# EAGLE design ESP_LoRa_Scale_V1.54 (EAGLE 9.6.0)
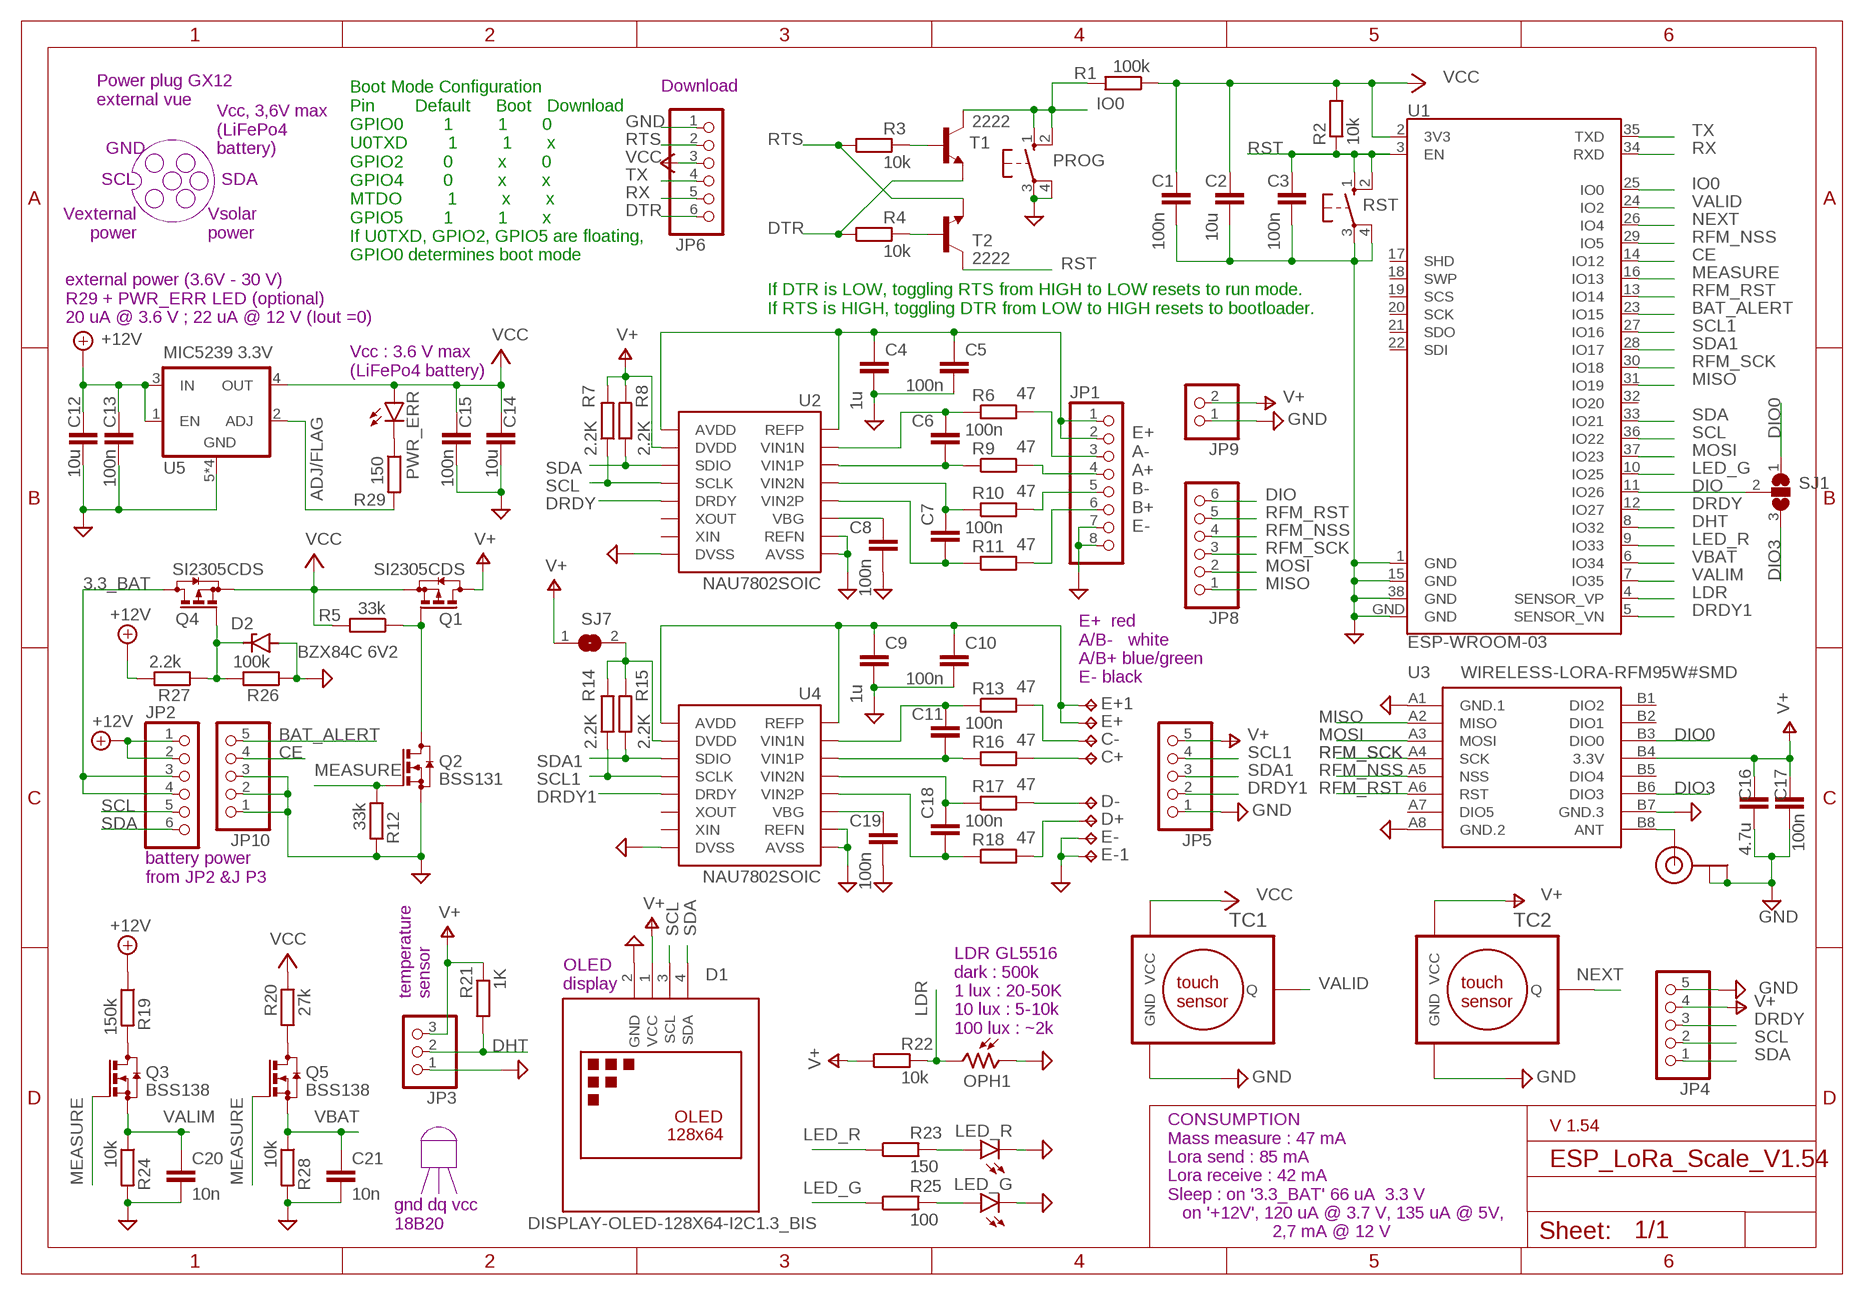
[diagram p0: schematic, sheet 1]

## Parts
C1  100n  CC1206  [C1206]
C2  10u  CC1210  [C1210]
C3  100n  CC1206  [C1206]
C4  1u  CC1210  [C1210]
C5  100n  CC1206  [C1206]
C6  100n  CC1206  [C1206]
C7  100n  CC1206  [C1206]
C8  100n  CC1206  [C1206]
C9  1u  CC1210  [C1210]
C10  100n  CC1206  [C1206]
C11  100n  CC1206  [C1206]
C12  10u  CC1210  [C1210]
C13  100n  CC1206  [C1206]
C14  10u  CC1210  [C1210]
C15  100n  CC1206  [C1206]
C16  4.7u  CC1210  [C1210]
C17  100n  CC1206  [C1206]
C18  100n  CC1206  [C1206]
C19  100n  CC1206  [C1206]
C20  10n  CC1206  [C1206]
C21  10n  CC1206  [C1206]
C+  TPTP17SQ  [TP17SQ]
C-  TPTP17SQ  [TP17SQ]
D1  DISPLAY-OLED-128X64-I2C1.3_BIS  [DISPLAY-OLED-128X64-1.3-I2C_BIS]
D2  BZX84C 6V2  BZX84CSMD  [TO236]
D+  TPTP17SQ  [TP17SQ]
D-  TPTP17SQ  [TP17SQ]
E+  TPTP17SQ  [TP17SQ]
E+1  TPTP17SQ  [TP17SQ]
E-  TPTP17SQ  [TP17SQ]
E-1  TPTP17SQ  [TP17SQ]
J1  U.FL  [U.FL]
JP1  PINHD-1X8  [1X08]
JP2  PINHD-1X6  [1X06]
JP3  PINHD-1X3  [1X03]
JP4  PINHD-1X5  [1X05]
JP5  PINHD-1X5  [1X05]
JP6  PINHD-1X6  [1X06]
JP8  PINHD-1X6  [1X06]
JP9  PINHD-1X2  [1X02]
JP10  PINHD-1X5  [1X05]
LED_G  LEDSMT1206  [1206]
LED_R  LEDSMT1206  [1206]
OPH1  VT93N2  [VT900]
PROG  10-XX  [B3F-10XX]
PWR_ERR  LEDSMT1206  [1206]
Q1  SI2305CDS  [SOT23]
Q2  BSS131  [SOT23]
Q3  BSS138  [SOT23]
Q4  SI2305CDS  [SOT23]
Q5  BSS138  [SOT23]
R1  100k  RR1206  [R1206]
R2  10k  RR1206  [R1206]
R3  10k  RR1206  [R1206]
R4  10k  RR1206  [R1206]
R5  33k  RR1206  [R1206]
R6  47  RR1206  [R1206]
R7  2.2K  RR1206  [R1206]
R8  2.2K  RR1206  [R1206]
R9  47  RR1206  [R1206]
R10  47  RR1206  [R1206]
R11  47  RR1206  [R1206]
R12  33k  RR1206  [R1206]
R13  47  RR1206  [R1206]
R14  2.2K  RR1206  [R1206]
R15  2.2K  RR1206  [R1206]
R16  47  RR1206  [R1206]
R17  47  RR1206  [R1206]
R18  47  RR1206  [R1206]
R19  150k  RR1206  [R1206]
R20  27k  RR1206  [R1206]
R21  1K  RR1206  [R1206]
R22  10k  RR1206  [R1206]
R23  150  RR1206  [R1206]
R24  10k  RR1206  [R1206]
R25  100  RR1206  [R1206]
R26  100k  RR1206  [R1206]
R27  2.2k  RR1206  [R1206]
R28  10k  RR1206  [R1206]
R29  150  RR1206  [R1206]
RST  10-XX  [B3F-10XX]
SJ1  SJ2W  [SJ_2]
SJ7  SJ  [SJ]
T1  2222  MMBT2222ALT1-NPN-SOT23-BEC  [SOT23-BEC]
T2  2222  MMBT2222ALT1-NPN-SOT23-BEC  [SOT23-BEC]
TC1  TTP223R_H  [TTP233RED_H]
TC2  TTP223R_H  [TTP233RED_H]
U1  ESP-WROOM-03  [ESP-WROOM-03]
U2  NAU7802SOIC  [SO16]
U3  WIRELESS-LORA-RFM95W#SMD  [WIRELESS-LORA-RFM95W#SMD]
U4  NAU7802SOIC  [SO16]
U5  MIC5239 3.3V  MIC5239-ADJMM  [MSOP08]

## Nets
3.3_BAT: JP2.3 JP2.4 Q4.3(D)
+12V: C12.1 C13.1 JP2.1 JP2.2 R19.1 R27.2 U5.1(EN) U5.3(IN)
A+: JP1.4 R9.2
A-: JP1.3 R6.2
ADJ/FLAG: R29.2 U5.2(ADJ)
ANT: J1.3(SIGNAL) U3.B8(ANT)
B+: JP1.6 R11.2
B-: JP1.5 R10.2
BAT_ALERT: JP10.5 U1.23(IO15)
CE: JP10.4 U1.14(IO12)
DHT: JP3.2 R21.1 U1.8(IO32)
DIO: JP8.6 SJ1.2 U1.11(IO26)
DIO0: SJ1.1 U3.B3(DIO0)
DIO3: SJ1.3 U3.B6(DIO3)
DRDY: JP4.3 U1.12(IO27) U2.12(DRDY)
DRDY1: JP5.2 U1.5(SENSOR_VN) U4.12(DRDY)
DTR: JP6.6 R4.1 T1.E
GND: C1.2 C2.2 C3.2 C4.2 C5.2 C8.2 C9.2 C10.2 C12.2 C13.2 C14.2 C15.2 C16.2 C17.2 C19.2 C20.2 C21.2 D1.2(GND) D2.A E-1.TP E-.TP J1.1(GND) J1.2(GND) JP1.7 JP1.8 JP3.1 JP4.5 JP5.1 JP6.1 JP9.1 JP10.1 JP10.2 JP10.3 LED_G.C LED_R.C OPH1.1 PROG.3(P) PROG.4(P1) Q2.2(S) R12.2 R24.2 R26.1 R28.2 RST.3(P) RST.4(P1) TC1.P$3(GND) TC2.P$3(GND) U1.1(GND) U1.15(GND) U1.38(GND) U1.GND U2.7(REFN) U2.8(AVSS) U2.9(DVSS) U3.A1(GND.1) U3.A8(GND.2) U3.B7(GND.3) U4.7(REFN) U4.8(AVSS) U4.9(DVSS) U5.5(GND) U5.6(GND) U5.7(GND) U5.8(GND)
IO0: PROG.1(S) PROG.2(S1) R1.2 T1.C U1.25(IO0)
LDR: OPH1.2 R22.2 U1.4(SENSOR_VP)
LED_G: R25.1 U1.10(IO25)
LED_R: R23.1 U1.9(IO33)
MEASURE: Q2.1(G) Q3.1(G) Q5.1(G) R12.1 U1.16(IO13)
MISO: JP8.1 U1.31(IO19) U3.A2(MISO)
MOSI: JP8.2 U1.37(IO23) U3.A3(MOSI)
N$1: Q1.1(G) Q2.3(D) R5.1
N$2: Q3.3(D) R19.2
N$4: R14.2 R15.2 SJ7.2 U4.15(DVDD)
N$5: Q5.3(D) R20.1
N$6: PWR_ERR.C R29.1
N$7: LED_R.A R23.2
N$8: LED_G.A R25.2
N$10: R3.2 T1.B
N$14: R4.2 T2.B
N$15: C8.1 U2.6(VBG)
N$16: C19.1 U4.6(VBG)
N$17: C11.2 R16.1 U4.3(VIN1P)
N$18: C11.1 R13.1 U4.2(VIN1N)
N$19: C6.2 R9.1 U2.3(VIN1P)
N$20: C6.1 R6.1 U2.2(VIN1N)
N$21: C7.1 R10.1 U2.4(VIN2N)
N$22: C7.2 R11.1 U2.5(VIN2P)
N$27: C18.1 R17.1 U4.4(VIN2N)
N$28: C18.2 R18.1 U4.5(VIN2P)
N$29: D+.TP R18.2
N$30: D-.TP R17.2
N$31: C9.1 C10.1 E+1.TP E+.TP U4.1(REFP) U4.16(AVDD)
N$32: C-.TP R13.2
N$33: C+.TP R16.2
N$34: C4.1 C5.1 JP1.1 JP1.2 U2.1(REFP) U2.16(AVDD)
N$35: D2.C Q4.1(G) R26.2 R27.1
NEXT: TC2.P$2(Q) U1.26(IO4)
RFM_NSS: JP8.4 U1.29(IO5) U3.A5(NSS)
RFM_RST: JP8.5 U1.13(IO14) U3.A6(RST)
RFM_SCK: JP8.3 U1.30(IO18) U3.A4(SCK)
RST: C3.1 R2.1 RST.1(S) RST.2(S1) T2.C U1.3(EN)
RTS: JP6.2 R3.1 T2.E
RX: JP6.5 U1.34(RXD)
SCL: D1.3(SCL) JP2.5 JP4.2 R7.1 U1.36(IO22) U2.13(SCLK)
SCL1: JP5.4 R14.1 U1.27(IO16) U4.13(SCLK)
SDA: D1.4(SDA) JP2.6 JP4.1 R8.1 U1.33(IO21) U2.14(SDIO)
SDA1: JP5.3 R15.1 U1.28(IO17) U4.14(SDIO)
TX: JP6.4 U1.35(TXD)
V+: C16.1 C17.1 D1.1(VCC) JP3.3 JP4.4 JP5.5 JP9.2 Q1.3(D) R7.2 R8.2 R21.2 R22.1 SJ7.1 TC2.P$1(VCC) U2.15(DVDD) U3.B4(3.3V)
VALID: TC1.P$2(Q) U1.24(IO2)
VALIM: C20.1 Q3.2(S) R24.1 U1.7(IO35)
VBAT: C21.1 Q5.2(S) R28.1 U1.6(IO34)
VCC: C1.1 C2.1 C14.1 C15.1 JP6.3 PWR_ERR.A Q1.2(S) Q4.2(S) R1.1 R2.2 R5.2 R20.2 TC1.P$1(VCC) U1.2(3V3) U5.4(OUT)
Unconnected: U1.17(SHD) U1.18(SWP) U1.19(SCS) U1.20(SCK) U1.21(SDO) U1.22(SDI) U1.32(IO20) U2.10(XIN) U2.11(XOUT) U3.A7(DIO5) U3.B1(DIO2) U3.B2(DIO1) U3.B5(DIO4) U4.10(XIN) U4.11(XOUT)

## Notes on the sheet
- Download
- Power plug GX12
  external vue
- GND
- Vcc, 3,6V max
  (LiFePo4
  battery)
- SCL | SDA
- Vexternal
  power
- Vsolar 
  power
- Boot Mode Configuration
  Pin        Default     Boot   Download
  GPIO0        1         1       0
  U0TXD        1         1       x
  GPIO2        0         x       0
  GPIO4        0         x       x
  MTDO         1         x       x
  GPIO5        1         1       x
  If U0TXD, GPIO2, GPIO5 are floating, 
  GPIO0 determines boot mode
- If DTR is LOW, toggling RTS from HIGH to LOW resets to run mode.
  If RTS is HIGH, toggling DTR from LOW to HIGH resets to bootloader.
- external power (3.6V - 30 V)
  R29 + PWR_ERR LED (optional)
  20 uA @ 3.6 V ; 22 uA @ 12 V (Iout =0)
- Vcc : 3.6 V max 
  (LiFePo4 battery)
- E+
  A-
  A+
  B-
  B+
  E-
- E+  red
  A/B-   white
  A/B+ blue/green
  E- black
- battery power
  from JP2 &J P3
- OLED 
  display
- temperature
  sensor
- LDR GL5516
  dark : 500k
  1 lux : 20-50K
  10 lux : 5-10k
  100 lux : ~2k
- V 1.54
- gnd dq vcc
  18B20
- CONSUMPTION
  Mass measure : 47 mA
  Lora send : 85 mA
  Lora receive : 42 mA
  Sleep : on '3.3_BAT' 66 uA  3.3 V
     on '+12V', 120 uA @ 3.7 V, 135 uA @ 5V,
                       2,7 mA @ 12 V

## Library data of the parts
C1-C21 = eagle-ltspice:C: CAPACITOR, European symbol; SPICEMODEL: NONE; SPICEPREFIX: C
C+ C- D+ D- E+ E+1 E- E-1 = testpad:TP: Test pad
D1 = diy-modules1.8-perso:DISPLAY-OLED-128X64-I2C: 128x64 Dot Matrix OLED Module based on SSD1306 chip Variant with I2C interface More details available here: http://www.instructables.com/id/Monochrome-096-i2c-OLED-display-with-arduino-SSD13/ SSD1306 datasheet: https://cdn-shop.adafruit.com/datasheets/SSD1306.pdf Click here to find device on ebay.com <http://www.ebay.com/sch/oled+display+128x64+iic> Note: There are two variants: I2C and SPI. Search for the proper version.
D2 = diode:BZX84CSMD: Z DIODE
J1 = microbuilder:U.FL: U.FL Antenna Connector
JP1 = pinhead:PINHD-1X8: PIN HEADER
JP2 JP6 JP8 = pinhead:PINHD-1X6: PIN HEADER
JP3 = pinhead:PINHD-1X3: PIN HEADER
JP4 JP5 JP10 = pinhead:PINHD-1X5: PIN HEADER
JP9 = pinhead:PINHD-1X2: PIN HEADER
LED_G LED_R PWR_ERR = led:LED: LED OSRAM: - CHIPLED LG R971, LG N971, LY N971, LG Q971, LY Q971, LO R971, LY R971 LH N974, LH R974 LS Q976, LO Q976, LY Q976 LO Q996 - Hyper CHIPLED LW Q18S LB Q993, LB Q99A, LB R99A - SideLED LS A670, LO A670, LY A670, LG A670, LP A670 LB A673, LV A673, LT A673, LW A673 LH A674 LY A675 LS A676, LA A676, LO A676, LY A676, LW A676 LS A679, LY A679, LG A679 - Hyper Micro SIDELED® LS Y876, LA Y876, LO Y876, LY Y876 LT Y87S - SmartLED LW L88C, LW L88S LB L89C, LB L89S, LG L890 LS L89K, LO L89K, LY L89K LS L896, LA L896, LO L896, LY L896 - TOPLED LS T670, LO T670, LY T670, LG T670, LP T670 LSG T670, LSP T670, LSY T670, LOP T670, LYG T670 LG T671, LOG T671, LSG T671 LB T673, LV T673, LT T673, LW T673 LH T674 LS T676, LA T676, LO T676, LY T676, LB T676, LH T676, LSB T676, LW T676 LB T67C, LV T67C, LT T67C, LS T67K, LO T67K, LY T67K, LW E67C LS E67B, LA E67B, LO E67B, LY E67B, LB E67C, LV E67C, LT E67C LW T67C LS T679, LY T679, LG T679 LS T770, LO T770, LY T770, LG T770, LP T770 LB T773, LV T773, LT T773, LW T773 LH T774 LS E675, LA E675, LY E675, LS T675 LS T776, LA T776, LO T776, LY T776, LB T776 LHGB T686 LT T68C, LB T68C - Hyper Mini TOPLED® LB M676 - Mini TOPLED Santana® LG M470 LS M47K, LO M47K, LY M47K Source: http://www.osram.convergy.de LUXEON: - LUMILED® LXK2-PW12-R00, LXK2-PW12-S00, LXK2-PW14-U00, LXK2-PW14-V00 LXK2-PM12-R00, LXK2-PM12-S00, LXK2-PM14-U00 LXK2-PE12-Q00, LXK2-PE12-R00, LXK2-PE12-S00, LXK2-PE14-T00, LXK2-PE14-U00 LXK2-PB12-K00, LXK2-PB12-L00, LXK2-PB12-M00, LXK2-PB14-N00, LXK2-PB14-P00, LXK2-PB14-Q00 LXK2-PR12-L00, LXK2-PR12-M00, LXK2-PR14-Q00, LXK2-PR14-R00 LXK2-PD12-Q00, LXK2-PD12-R00, LXK2-PD12-S00 LXK2-PH12-R00, LXK2-PH12-S00 LXK2-PL12-P00, LXK2-PL12-Q00, LXK2-PL12-R00 Source: www.luxeon.com KINGBRIGHT: KA-3528ASYC Source: www.kingbright.com
OPH1 = photo-elements:VT9: Photoconductive Cell VT900 Series Source: http://optoelectronics.perkinelmer.com/content/Datasheets/DTS_vt900seriesdatasheet.pdf
PROG RST = switch-omron:10-XX: OMRON SWITCH; MPN: B3F-1000; OC_FARNELL: 176432; OC_NEWARK: 36M3542
Q1 Q4 = transistor-small-signal-perso:SI2305CDS: P-CHANNEL MOS FET
Q2 = transistor-small-signal-perso:BSS131: N-CHANNEL MOS FET
Q3 Q5 = detect:BSS138: N-CHANNEL MOS FET
R1-R29 = eagle-ltspice:R: RESISTOR, European symbol; SPICEMODEL: NONE; SPICEPREFIX: R
SJ1 = jumper:SJ2W: SMD solder JUMPER
SJ7 = jumper:SJ: SMD solder JUMPER
T1 T2 = transistor:*-NPN-: NPN Transistror BF959 corrected 2008.03.06
TC1 TC2 = esp32-lora:TTP223: Touch Key Switch
U1 = esp32-sparkfun (1):ESP-WROOM-03; OC_FARNELL: unknown
U2 U4 = SparkFun-IC-Conversion:NAU7802: 24-bit load cell conversion IC with I2C interface in SOIC-16 package. Similar to HX711 but with true I2C interface.; PROD_ID: IC-14299
U3 = diy-modules:WIRELESS-LORA-RFM95W: 868/915 MHz LoRa Radio Transceiver Module based on SX1276 chip Click here to find device on ebay.com <http://www.ebay.com/sch/RFM95W+transceiver>
U5 = micrel:MIC5239-ADJ: LDO REGULATOR

## Board
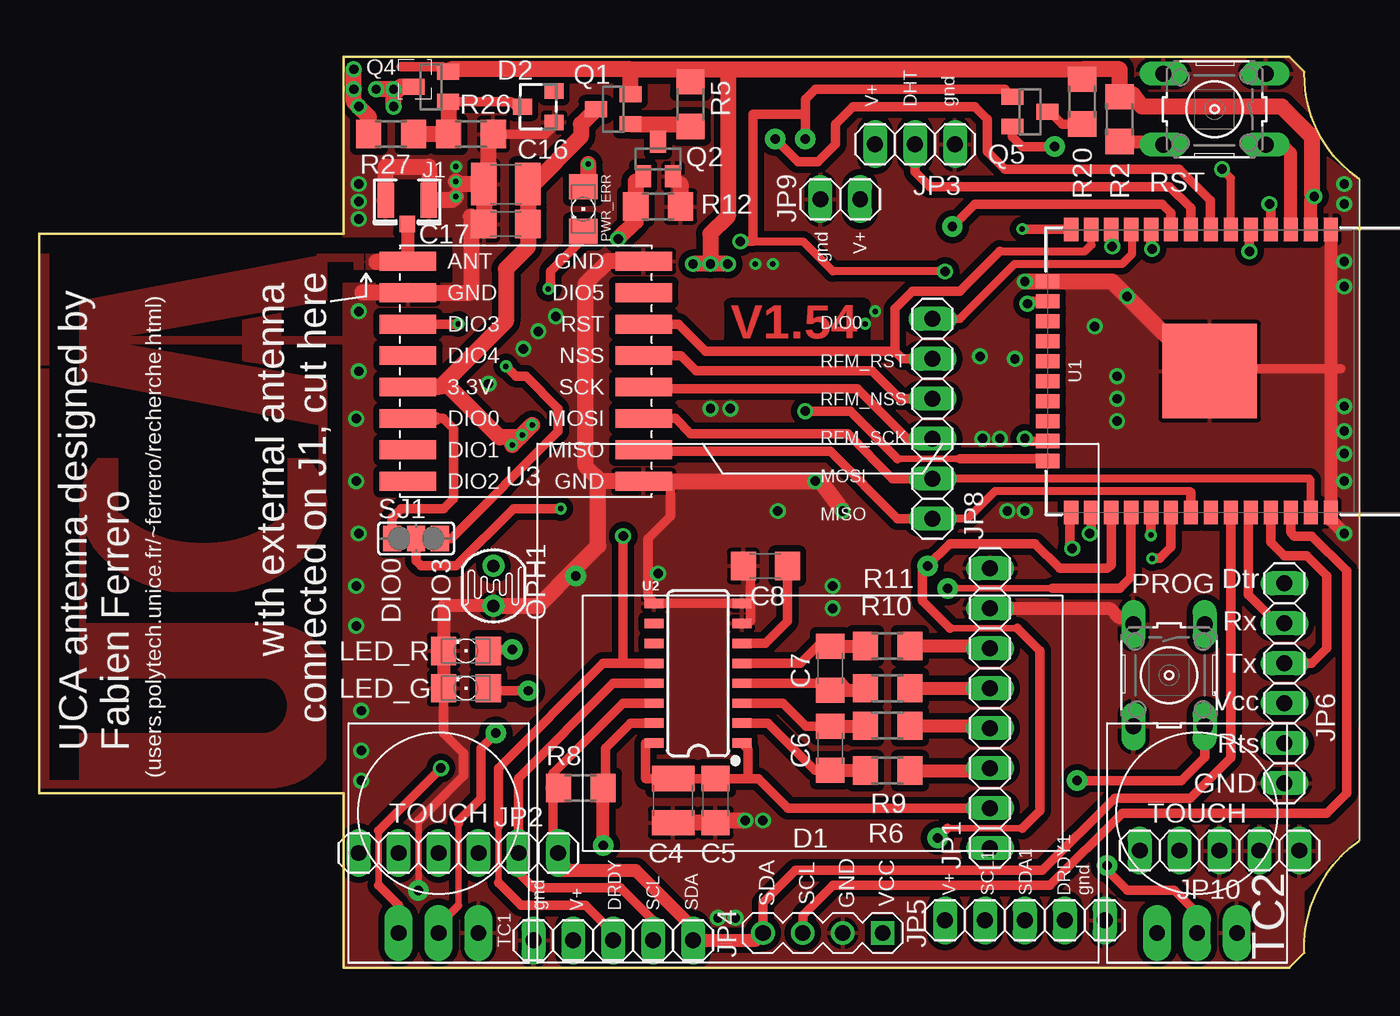
[diagram p1: board, top side]
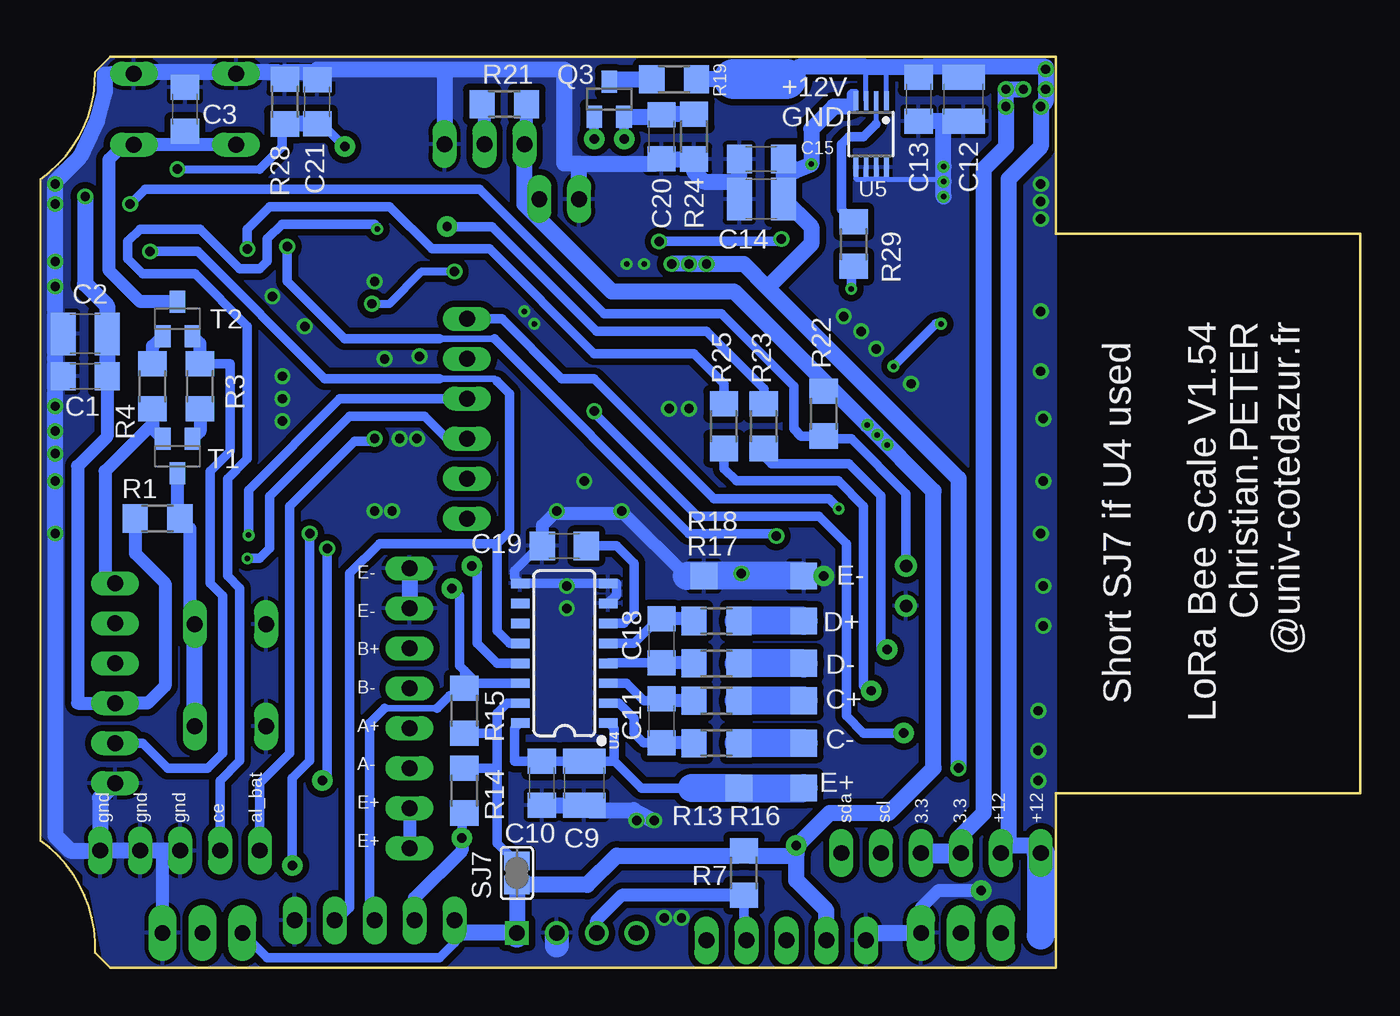
[diagram p2: board, bottom side, seen from below]

Size 83.98 x 57.94 mm. Coordinates in mm from the lower left corner, seen from the top.
Outline: 19.37,0 19.37,11.11 0,11.11 0,46.67 19.37,46.67 19.37,57.94 79.53,57.94 80.49,56.99 arc56 83.98,50.16 83.98,8.1 arc56 80.49,0.95 79.53,0 19.37,0
Copper layers (1*16): Top 0.035mm / dielectric 1.5mm / Bottom 0.035mm
Design rules "default *": minimum track width 6mil, minimum drill 0.35mm, track to track 6mil, track to pad 6mil, pad to pad 6mil, via to via 6mil, smd to smd 6mil, copper to edge 0mil, drill to drill 6mil, minimum pad ring 10mil, minimum via ring 8mil, stop-mask expansion 4mil, vias tented up to drill 0mil, thermal gap 10mil

### Footprints (pad centres in the part's own frame; a part is rotated, then mirrored left to right if it is on the bottom)
C1206 = smd 1.6 x 1.8: 1 -1.4,0; 2 1.4,0
C1210 = smd 1.6 x 2.7: 1 -1.4,0; 2 1.4,0
TP17SQ = smd 1.7 x 1.7: TP 0,0
DISPLAY-OLED-128X64-1.3-I2C_BIS = drill 1 square: 1 -3.81,14.605 | drill 1: 2 -1.27,14.605; 3 1.27,14.605; 4 3.81,14.605
TO236 = smd 1 x 1.2: A -1,-1; C 0,1; NC 1,-1
U.FL = smd 2.2 x 1.05: 1 0,1.375; 2 0,-1.375 | smd 1.05 x 1: 3 1.525,0
1X08 = drill 1.016 long: 1 -8.89,0; 2 -6.35,0; 3 -3.81,0; 4 -1.27,0; 5 1.27,0; 6 3.81,0; 7 6.35,0; 8 8.89,0
1X06 = drill 1.016 long: 1 -6.35,0; 2 -3.81,0; 3 -1.27,0; 4 1.27,0; 5 3.81,0; 6 6.35,0
1X03 = drill 1.016 long: 1 -2.54,0; 2 0,0; 3 2.54,0
1X05 = drill 1.016 long: 1 -5.08,0; 2 -2.54,0; 3 0,0; 4 2.54,0; 5 5.08,0
1X02 = drill 1.016 long: 1 -1.27,0; 2 1.27,0
1206 = smd 1.6 x 1.803: A -1.422,0; C 1.422,0
VT900 = drill 0.8 pad 1.4: 1 -1.27,0; 2 1.27,0
B3F-10XX = drill 1.016 long: 1 -3.251,2.261; 2 3.251,2.261; 3 -3.251,-2.261; 4 3.251,-2.261
SOT23 = smd 1 x 1.4: 1 -0.95,-1.1; 2 0.95,-1.1; 3 0,1.1
R1206 = smd 1.6 x 1.803: 1 -1.422,0; 2 1.422,0
SJ_2 = smd 1.168 x 1.6: 1 -1.524,0; 2 0,0; 3 1.524,0
SJ = smd 1.168 x 1.6: 1 -0.762,0; 2 0.762,0
SOT23-BEC = smd 1 x 1.4: B -0.95,-1.1; C 0,1.1; E 0.95,-1.1
TTP233RED_H = drill 1 pad 1.778 long: P$1 1.905,2.54; P$2 1.905,0; P$3 1.905,-2.54
ESP-WROOM-03 = smd 0.9 x 1.5: 1 7.7,9; 2 6.43,9; 3 5.16,9; 4 3.89,9; 5 2.62,9; 6 1.35,9; 7 0.08,9; 8 -1.19,9; 9 -2.46,9; 10 -3.73,9; 11 -5,9; 12 -6.27,9; 13 -7.54,9; 14 -8.81,9; 25 -8.81,-9; 26 -7.54,-9; 27 -6.27,-9; 28 -5,-9; 29 -3.73,-9; 30 -2.46,-9; 31 -1.19,-9; 32 0.08,-9; 33 1.35,-9; 34 2.62,-9; 35 3.89,-9; 36 5.16,-9; 37 6.43,-9; 38 7.7,-9 | smd 1.5 x 0.9: 15 -10.3,5.715; 16 -10.3,4.445; 17 -10.3,3.175; 18 -10.3,1.905; 19 -10.3,0.635; 20 -10.3,-0.635; 21 -10.3,-1.905; 22 -10.3,-3.175; 23 -10.3,-4.445; 24 -10.3,-5.715 | smd 6 x 6: GND 0,0
SO16 = smd 0.6 x 1.2: 1 -4.445,-2.8; 2 -3.175,-2.8; 3 -1.905,-2.8; 4 -0.635,-2.8; 5 0.635,-2.8; 6 1.905,-2.8; 7 3.175,-2.8; 8 4.445,-2.8; 9 4.445,2.8; 10 3.175,2.8; 11 1.905,2.8; 12 0.635,2.8; 13 -0.635,2.8; 14 -1.905,2.8; 15 -3.175,2.8; 16 -4.445,2.8
WIRELESS-LORA-RFM95W#SMD = smd 3.6 x 1.2: A1 -7.5,7; A2 -7.5,5; A3 -7.5,3; A4 -7.5,1; A5 -7.5,-1; A6 -7.5,-3; A7 -7.5,-5; A8 -7.5,-7; B1 7.5,7; B2 7.5,5; B3 7.5,3; B4 7.5,1; B5 7.5,-1; B6 7.5,-3; B7 7.5,-5; B8 7.5,-7
MSOP08 = smd 0.3 x 1.2: 1 -0.976,-2.113; 2 -0.326,-2.113; 3 0.324,-2.113; 4 0.974,-2.113; 5 0.974,2.112; 6 0.324,2.112; 7 -0.326,2.112; 8 -0.976,2.112

### Placement (x,y rotation side)
C1  81.12,37.62 180 bottom
C2  81.12,40.32 180 bottom
C3  74.77,54.61 90 bottom
C4  40.32,10.64 270 top
C5  43.02,10.64 270 top
C6  50.32,13.97 90 top
C7  50.32,19.05 90 top
C8  46.2,25.56 180 top
C9  49.37,11.75 270 bottom
C10  52.07,11.75 270 bottom
C11  44.45,15.72 90 bottom
C12  25.24,55.25 270 bottom
C13  28.1,55.25 270 bottom
C14  38.1,48.9 180 bottom
C15  38.1,51.44 180 bottom
C16  29.69,49.85 180 top
C17  29.69,47.31 180 top
C18  44.45,20.8 90 bottom
C19  50.64,26.83 180 bottom
C20  44.45,52.86 270 bottom
C21  66.36,55.09 90 bottom
C+  35.4,16.99 180 bottom
C-  35.4,14.29 180 bottom
D1  49.85,16.83 180 top
D2  31.75,54.77 90 top
D+  35.4,22.07 180 bottom
D-  35.4,19.37 180 bottom
E+  39.53,11.43 180 bottom
E+1  35.4,11.43 0 bottom
E-  35.4,24.92 180 bottom
E-1  41.75,24.92 0 bottom
J1  23.42,48.82 270 top
JP1  60.48,16.51 90 top
JP2  26.67,7.3 0 top
JP3  55.72,52.39 180 top
JP4  36.51,1.75 180 top
JP5  62.71,3.02 180 top
JP6  79.22,18.1 90 top
JP8  56.83,34.93 90 top
JP9  50.96,48.9 0 top
JP10  75.09,7.46 180 top
LED_G  27.15,17.78 180 top
LED_R  27.15,20.16 180 top
OPH1  28.89,24.29 90 top
PROG  71.88,18.61 270 top
PWR_ERR  34.61,48.26 270 top
Q1  36.51,54.61 90 top
Q2  39.37,51.44 0 top
Q3  47.78,55.25 0 bottom
Q4  24.92,56.04 90 top
Q5  63.02,54.45 270 top
R1  76.52,28.58 0 bottom
R2  68.74,53.98 90 top
R3  73.82,36.99 270 bottom
R4  76.84,36.99 90 bottom
R5  41.43,54.93 90 top
R6  53.98,12.54 0 top
R7  39.21,6.03 90 bottom
R8  34.45,11.43 0 top
R9  53.98,15.4 0 top
R10  53.98,17.78 0 top
R11  53.98,20.48 0 top
R12  39.37,48.42 0 top
R13  40.96,14.29 0 bottom
R14  56.99,11.27 90 bottom
R15  56.99,16.35 270 bottom
R16  40.96,16.99 0 bottom
R17  40.96,19.37 0 bottom
R18  40.96,22.07 0 bottom
R19  43.66,56.52 180 bottom
R20  66.36,55.09 90 top
R21  54.45,54.93 0 bottom
R22  34.13,35.24 270 bottom
R23  37.94,34.45 270 bottom
R24  42.39,52.86 270 bottom
R25  40.48,34.45 270 bottom
R26  27.46,53.02 180 top
R27  22.38,53.02 180 top
R28  68.42,55.09 90 bottom
R29  32.23,46.04 90 bottom
RST  74.77,54.61 180 top
SJ1  23.97,27.3 0 top
SJ7  53.66,6.03 90 bottom
T1  75.25,32.54 180 bottom
T2  75.25,41.27 0 bottom
TC1  25.4,0.32 90 top
TC2  73.66,0.32 90 top
U1  74.46,37.95 0 top
U2  41.91,18.73 90 top
U3  30.96,37.94 180 top
U4  50.64,20 90 bottom
U5  31.12,53.02 180 bottom

### Tracks (layer width: path | path; a pad name or v marks a point on that pad's centre or on a via)
3.3_BAT  (via drill 0.6)
  Top 1.016: 22.86,55.88 v21.43,55.88 | Q4.3 23.02,56.04 22.86,55.88 | v22.54,54.77 22.54,55.56 22.86,55.88
  Bottom 1.016: v21.43,55.88 v22.54,55.88 v22.54,54.77 22.54,52.23 23.97,50.8 23.97,9.84 25.4,8.41 JP2.3
  Bottom 1.27: JP2.4 JP2.3
+12V  (via drill 0.6)
  Top 1.016: R27.2 20.96,54.13 v20.32,54.77 20,55.09 v20,55.88 v20,57.15
  Bottom 0.305: 27.79,57.3 27.78,57.31 | U5.3 31.44,57.3 31.43,57.31 | U5.1 30.14,57.29 30.16,57.31
  Bottom 1.016: 25.24,57.31 20,57.31 20,55.09 v20.32,54.77 20.32,52.23 22.38,50.16 22.38,7.78 | 25.24,57.31 27.78,57.31 30.16,57.31 31.43,57.31 | C12.1 25.24,57.31 | C13.1 28.1,56.99 27.79,57.3 | 39.85,56.51 R19.1 | 31.44,57.3 35.73,57.3 36.51,56.51 | 22.38,7.78 JP2.2 | JP2.1 20.8,7.78 22.38,7.78
  Bottom 1.778: JP2.1 20.32,2.06
  Bottom 2.54: 36.51,56.51 39.85,56.51
A+
  Top 0.813: R9.2 60.33,15.4 JP1.4
A-
  Top 0.813: R6.2 60.33,12.54 JP1.3
ADJ/FLAG
  Bottom 0.305: U5.2 30.8,53.66
  Bottom 0.61: 30.8,53.66 31.59,52.86 32.54,52.86 33.02,52.39 33.02,48.25 R29.2
ANT
  Top 0.813: U3.B8 23.46,47.25 J1.3
  Top 1.016: U3.B8 23.42,44.9 21.45,44.9
  pour Top: 14.99,11.42 0.14,11.42 0.14,38.12 0.64,38.12 0.64,11.92 2.54,11.92 2.54,14.92 14.19,14.92 14.32,14.92 14.46,14.94 14.59,14.97 14.73,15.02 14.85,15.08 14.97,15.15 15.09,15.23 15.2,15.33 15.3,15.43 15.39,15.54 15.48,15.66 15.55,15.79 15.61,15.93 15.67,16.07 15.71,16.21 15.74,16.36 15.76,16.51 15.76,16.67 15.76,16.82 15.74,16.97 15.71,17.12 15.67,17.26 15.61,17.41 15.55,17.54 15.48,17.67 15.39,17.79 15.3,17.9 15.2,18 15.09,18.1 14.97,18.18 14.85,18.25 14.73,18.31 14.59,18.36 14.46,18.39 14.32,18.41 14.19,18.42 2.54,18.42 2.54,28.92 2.57,28.92 2.55,29.53 2.61,30.14 2.75,30.73 2.99,31.34 3.31,31.9 3.72,32.41 5.03,32.41 5.03,28.92 5.17,28.92 5.5,28.62 5.85,28.36 6.22,28.12 6.63,27.89 7.06,27.69 7.5,27.51 7.96,27.36 8.44,27.24 8.92,27.14 9.42,27.07 9.92,27.02 10.42,27.01 10.92,27.02 11.42,27.07 11.92,27.14 12.41,27.24 12.88,27.36 13.35,27.51 13.78,27.69 14.21,27.89 14.62,28.12 14.99,28.36 15.34,28.62 15.67,28.92 15.82,28.92 15.82,32.41 17.13,32.41 17.25,32.26 17.37,32.11 17.49,31.94 17.59,31.78 17.69,31.62 17.79,31.45 17.79,34.51 2.54,37.42 2.54,42.41 17.64,45.29 17.64,45.42 20.14,45.42 20.14,45.41 20.64,45.41 20.64,44.93 20.76,44.93 20.76,45.41 22.54,45.41 22.54,44.39 20.77,44.39 20.77,44.87 20.64,44.87 20.64,44.4 19.99,44.4 19.99,44.92 18.31,44.92 18.31,42.41 5.61,40.17 12.91,40.17 12.91,41.22 15.4,41.66 15.4,40.17 19.99,40.17 19.99,40.42 20.39,40.42 20.39,39.41 19.99,39.41 19.99,39.67 15.4,39.67 15.4,38.16 14.21,38.38 13.08,38.55 13.08,38.59 12.91,38.61 12.91,39.67 5.61,39.67 18.31,37.42 18.31,34.42 18.24,34.43 18.24,30.17 18.3,29.63 18.29,29.08 18.21,28.54 18.06,27.99 17.83,27.47 17.55,26.98 17.18,26.48 16.76,26.03 16.3,25.61 15.76,25.21 15.17,24.87 14.57,24.57 13.89,24.29 13.2,24.08 12.49,23.92 8.35,23.92 7.75,24.05 7.15,24.23 6.57,24.44 6.03,24.68 5.51,24.95 5.02,25.27 4.58,25.59 4.16,25.94 3.79,26.34 3.47,26.73 3.19,27.15 2.95,27.59 2.95,21.92 14.99,21.92 14.99,21.9 15.4,21.85 15.81,21.75 16.21,21.62 16.59,21.44 16.96,21.23 17.31,20.99 17.65,20.71 17.96,20.4 18.24,20.06 18.24,13.27 17.96,12.93 17.65,12.62 17.31,12.34 16.96,12.1 16.59,11.89 16.21,11.71 15.81,11.58 15.4,11.48 14.99,11.43
ANT1
  pour Top: 0.64,38.31 0.14,38.31 0.14,45.42 0.64,45.42
B+
  Top 0.813: R11.2 60.33,20.48 JP1.6
B-
  Top 0.813: R10.2 JP1.5
BAT_ALERT  (via drill 0.6)
  Top 0.61: U1.23 62.87,33.5 v62.71,33.65
  Bottom 0.61: JP10.5 70.01,11.75 68.1,13.65 68.1,29.37 63.98,33.5 62.87,33.5 v62.71,33.65
CE  (via drill 0.35)
  Top 0.61: v62.55,46.99 65.61,46.99 U1.14
  Bottom 0.61: JP10.4 72.55,11.91 71.28,13.18 71.28,24.13 72.07,24.92 72.07,31.12 70.8,32.38 70.8,36.58 70.81,36.59 70.81,37.39 70.8,37.39 70.8,40.8 74.14,44.13 77.47,44.13 78.42,45.08 78.42,46.2 77.63,46.99 73.82,46.99 71.28,44.45 70.01,44.45 69.53,44.93 69.53,46.36 68.58,47.31 62.71,47.31 62.55,47.15 v62.55,46.99
DHT
  Top 0.61: U1.8 73.27,48.33 71.91,49.69 56.67,49.69 55.72,50.64 JP3.2
  Bottom 0.813: JP3.2 55.72,54.78 R21.1
DIO  (via drill 0.35)
  Top 0.508: JP8.6 58.26,41.27 58.58,41.27 62.07,44.77 68.9,44.77 69.53,45.4 69.53,46.88 U1.11
  Top 0.61: SJ1.2 23.97,25.88 24.29,25.56 26.51,25.56 30.16,29.21 v33.18,29.21
  Bottom 0.61: v33.18,29.21 33.81,29.85 41.12,29.85 48.74,37.47 50.8,37.47 54.61,41.27 JP8.6
DIO0
  Top 0.61: U3.B3 25.7,34.94 26.35,34.29 26.35,29.85 25.72,29.21 23.02,29.21 22.45,28.64 SJ1.1
  Top 0.813: U3.B3 25.23,34.94
DIO3  (via drill 0.35)
  Top 0.61: U3.B6 26.65,40.94 | v29.69,38.26 30.32,37.62 30.96,37.62 33.02,35.56 33.02,34.13 26.19,27.3 SJ1.3
  Top 0.813: 26.65,40.94 v26.67,40.96
  Bottom 0.61: v26.67,40.96 26.99,40.96 v29.69,38.26
DRDY  (via drill 0.6)
  Top 0.406: 29.21,9.05 29.21,5.4
  Top 0.61: 29.21,9.05 29.21,12.7 35.88,19.37 37.15,19.37 | 29.21,5.4 30.64,3.97 34.77,3.97 36.51,2.22 JP4.3 | U2.12 37.15,19.37 | v37.15,27.46 37.15,19.37 | U1.12 68.19,45.95 v68.26,45.88
  Bottom 0.406: 58.58,40.01 55.09,40.01
  Bottom 0.61: v37.15,27.46 37.31,27.62 42.7,27.62 55.09,40.01 | v68.26,45.88 68.26,43.66 64.61,40.01 58.58,40.01
DRDY1  (via drill 0.6)
  Top 0.61: U1.5 76.99,46.86 v76.99,45.56
  Bottom 0.406: 54.93,37.31 55.09,37.47 58.58,37.47
  Bottom 0.61: U4.12 54.13,20.64 54.93,21.43 54.93,26.99 | 54.93,26.99 54.13,27.78 54.13,36.51 54.93,37.31 | 58.58,37.47 65.88,37.47 73.98,45.56 v76.99,45.56 | 54.93,26.99 62.39,26.99 64.29,25.08 64.29,3.81 65.09,3.02 JP5.2
DTR
  Bottom 0.813: T1.E 76.84,34.28 R4.1 76.84,34.61 79.85,31.59 79.85,25.08 JP6.6
GND  (via drill 0.35, 0.6, 0.6 pad 1.3)
  Top 0.406: v24.13,4.92 24.13,9.37
  Top 0.508: Q2.2 40.79,49.86
  Top 0.61: U2.7 45.09,21.91 45.24,22.07 45.24,23.18 | 45.24,23.18 U2.8 U2.9 38.74,23.55 38.74,27.3 40.16,28.73 40.16,30.94 | U3.A1 36.57,31.12 37.62,31.12 | U1.GND 74.62,38.1 82.8,38.1 | 69.62,22.27 PROG.3 | LED_G.C 25.72,14.92 26.99,13.65 26.99,12.23 24.13,9.37 | D2.A 32.75,53.55 32.23,53.02 R26.1 | C8.2 45.24,25.11 45.24,23.18
  Top 0.813: U1.1 U1.38 82.16,28.49 v83.03,27.62 | JP1.7 68.1,22.86 68.69,22.27 69.62,22.27 | OPH1.1 25.72,23.02 LED_R.C LED_G.C
  Top 1.016: 20.56,42.94 U3.B7 27.46,42.94 27.46,47.78 | J1.2 22.04,50.96 24.79,50.96 J1.1 26.28,48.82 v26.51,49.05 | C16.2 C17.2 | C16.2 28.57,50.13 28.57,52.7 R26.1 | 40.79,49.86 R12.2 | U3.A8 36.18,44.94 34.77,43.53 34.77,31.91 35.73,30.94 U3.A1 40.16,30.94 49.7,30.94 v51.12,29.05 | U1.GND 74.31,38.1 73.82,38.1 68.26,43.66 U1.15 v62.71,43.66 | v44.93,9.37 43.15,9.37 C5.2 C4.2 | OPH1.1 31.75,23.02 34.13,25.4 | 34.13,25.4 35.56,26.83 35.56,30.94 | v34.13,24.92 34.13,25.4 | C16.2 26.67,49.85 v26.51,50.01
  Bottom 0.305: U5.5 32.09,50.19 32.07,50.16 31.43,50.16 | 31.43,50.16 U5.6 | U5.7 30.79,50.17 | 30.79,50.17 30.8,50.16 31.43,50.16 | 30.14,50.19 30.16,50.16 30.78,50.16 30.79,50.17 | U5.8 30.14,50.19 | 30.14,50.19 30.12,50.16 26.67,50.16 v26.51,50.01
  Bottom 0.61: RST.4 71.6,56.95 71.6,56.99 | R28.2 68.42,56.99 | C21.2 66.36,56.99 66.36,57.15 | C19.2 52.23,26.83 53.82,25.24 53.82,24.82 U4.9 U4.8 47.31,24.45 47.31,23.71 U4.7 | JP5.1 67.79,3.33
  Bottom 0.813: 27.94,54 C13.2 | RST.3 78.11,56.95 78.11,56.99 | C3.2 74.77,56.99 | C19.2 52.04,28.13 51.28,28.89 46.83,28.89 42.86,24.92 | C2.2 83.03,40.32 | C1.2 83.03,37.62 | TC2.P$3 76.2,7.46 | TC1.P$3 27.94,3.81 26.83,4.92 v24.13,4.92
  Bottom 1.016: JP10.3 76.2,7.46 JP10.2 JP10.1 | v83.03,27.62 83.03,8.41 82.07,7.46 JP10.1 | 83.03,27.46 83.03,37.62 83.03,40.32 83.03,50.01 81.44,51.59 80.33,53.97 79.85,55.72 79.85,56.83 78.11,56.99 74.77,56.99 71.6,56.99 68.9,56.99 R28.2 | 68.42,56.99 66.36,56.99 | 66.36,57.15 58.26,57.15 | 58.26,57.15 50.64,57.15 50.64,51.15 49.72,51.15 | R24.2 42.35,51.41 | R24.2 44.43,51.44 C20.2 44.77,51.15 49.72,51.15 | 58.26,57.15 JP3.1 | JP10.1 80.17,10.8 JP6.1 | C10.2 C9.2 49.05,10.03 46.23,10.03 v44.93,9.37 | E-.TP v34.13,24.92 | JP4.5 30.96,2.22 TC1.P$3 | JP5.1 67.95,3.02 | 49.53,49.05 JP9.1 49.69,51.12 49.72,51.15 | R24.2 42.39,50.64 41.75,50.01 39.66,50.01 39.5,50.16 C15.2 | C12.2 26.51,53.84 | 26.51,53.84 27.78,53.84 27.94,54 | v26.51,49.05 v26.51,50.01 v26.51,50.96 26.51,53.84 | JP1.8 JP1.7
  Bottom 1.524: D1.2 51.12,1.43
  Bottom 1.778: E-.TP 42.86,24.92
  other vias: 20.32,41.75 83.03,43.34 83.03,35.72 49.37,30.96 46.99,29.05 61.59,29.05 83.03,48.58 83.03,30.96 83.03,44.93 83.03,49.85 20.32,37.94 83.03,34.13 83.03,32.7 20.16,34.93 20.16,30.96 20.32,27.62 20.16,24.29 20.16,21.75 20.48,16.35 20.48,13.81 20.48,11.91 68.58,36.2 68.58,37.62 68.58,34.77 42.7,35.56 43.97,35.56 69.22,42.7 67.15,40.8 62.07,38.73 59.85,38.89 45.56,44.77 46.67,44.77 52.55,40.96 53.18,41.75 61.12,33.66 62.71,29.05 60.01,33.66 43.18,3.18 44.29,3.18 46.04,9.37 28.58,37.15 30.8,39.37 31.75,40.48 32.86,41.43 20.32,47.62 20.32,49.85 20.32,48.74 50.48,24.29 50.48,22.86 39.37,25.08
  pour Top (isolate 0.406): 19.37,0 19.37,43.5 26.35,43.5 26.35,46.51 19.37,46.51 19.37,57.79 79.53,57.79 80.33,56.99 80.33,55.56 81.81,51.62 83.82,50.12 83.93,8.33 81.9,6.43 81.9,6.33 80.41,4.85 80.41,1.04 79.38,0
  pour Bottom (isolate 0.406): 19.37,0 19.37,57.79 79.53,57.79 80.33,56.99 80.33,52.72 83.82,50.13 83.93,8.45 81.21,5.89 81.21,5.32 80.79,4.91 79.98,0.61 79.38,0
IO0  (via drill 0.6, 0.6 pad 1.3)
  Top 0.61: U1.25 65.56,28.86 65.56,26.51 v65.72,26.67 | v66.04,11.91 72.66,11.91 74.14,13.39 PROG.2
  Bottom 0.61: v66.04,11.91 65.72,12.22 v65.72,26.67
  Bottom 0.813: T1.C 75.25,28.73 R1.2 74.46,27.94 74.46,25.08 | 74.46,25.08 74.46,22.17 PROG.1 | 74.46,25.08
  Bottom 1.016: PROG.2 PROG.1
LDR  (via drill 0.6)
  Top 0.61: v78.26,48.58 78.35,48.49 U1.4
  Bottom 0.61: v78.26,48.58 77.31,49.53 56.04,49.53 48.1,41.59 40.64,41.59 36.04,36.99 36.04,34.29 35.57,33.82 R22.2 33.97,33.65 32.39,33.65 28.89,30.16 OPH1.2
LED_G  (via drill 0.6)
  Top 0.61: U1.10 70.73,45.79 v70.8,45.72
  Bottom 0.61: v70.8,45.72 70.8,46.99 69.37,48.42 61.75,48.42 59.06,45.72 55.4,45.72 48.74,39.05 42.39,39.05 40.48,37.14 R25.1
LED_R  (via drill 0.6 pad 1.3)
  Top 0.61: U1.9 72,48.01 71.45,48.57 59.53,48.57 v58.1,47.14
  Bottom 0.61: v58.1,47.14 55.24,47.14 48.58,40.48 41.59,40.48 37.94,36.84 R23.1
MEASURE  (via drill 0.6, 0.6 pad 1.3)
  Top 0.508: v57.63,44.29 50.48,44.29 48.58,46.2 v44.61,46.2 | Q2.1 38.09,50.01
  Top 0.61: Q5.1 61.45,55.88 49.37,55.88 48.74,55.25 48.74,54.29 | v44.61,46.2 45.4,46.2 45.4,54.29 48.74,54.29 | 48.74,54.29 v48.74,52.7 | U1.16 63.03,42.39 v62.87,42.23
  Top 1.016: 38.09,50.01 37.94,50.01 R12.1 37.94,47.47 v36.83,46.36
  Bottom 0.508: v62.87,42.23 61.76,42.23 59.71,44.29 v57.63,44.29
  Bottom 0.61: v36.83,46.36 36.83,46.2 v44.61,46.2 | Q3.1 v48.74,52.7
MISO
  Top 0.508: 73.27,30.25 73.21,30.32 60.8,30.32 59.06,28.58 JP8.1 | 37.58,32.87 U3.A2
  Top 0.61: U1.31 73.27,30.25 | 37.58,32.87 37.68,32.76 37.78,32.86 50.32,32.86 54.61,28.58 JP8.1
MOSI
  Top 0.508: U1.37 80.89,31.02 80.8,31.12 JP8.2
  Top 0.61: U3.A3 40.47,34.94 41.43,33.97 51.44,33.97 54.29,31.12 JP8.2
N$1
  Top 0.508: Q2.3 39.2,52.7 39.2,53.51
  Top 0.61: R5.1 39.2,53.51
  Top 1.016: Q1.1 41.28,53.66 R5.1
N$2
  Bottom 1.016: Q3.3 47.61,56.51 R19.2
N$4
  Bottom 0.61: U4.15 54.29,16.83 54.93,16.19 54.93,14.92 | 54.93,14.92 R15.2 | 54.93,14.92 54.93,12.7 | 54.93,12.7 54.93,12.69 R14.2 | 54.93,12.7 54.93,7.94 53.78,6.79 SJ7.2
N$5
  Top 0.61: Q5.3 64.28,54.45 64.29,54.46 65.09,53.66 R20.1
N$6  (via drill 0.35)
  Top 0.61: PWR_ERR.C 34.61,46.36 32.54,44.29 32.54,43.18 v32.39,43.18
  Bottom 0.61: v32.39,43.18 32.39,44.46 R29.1
N$7  (via drill 0.6 pad 1.3)
  Top 0.61: LED_R.A 28.65,20.24 v30.08,20.24
  Bottom 0.61: v30.08,20.24 30.48,20.24 30.48,30.01 32.54,32.07 37.47,32.07 37.94,32.55 R23.2
N$8  (via drill 0.6 pad 1.3)
  Top 0.61: LED_G.A 28.73,17.78 28.79,17.74 28.8,17.62 v31.12,17.62
  Bottom 0.61: R25.2 40.48,31.76 39.69,30.96 33.19,30.96 31.59,29.37 31.59,17.94 31.27,17.62 v31.12,17.62
N$10
  Bottom 0.813: T1.B 73.82,34.12 R3.2
N$14
  Bottom 0.813: R4.2 76.84,39.54 T2.B
N$15
  Top 0.61: U2.6 46.2,20.64 47.6,22.04 C8.1
N$16
  Bottom 0.61: C19.1 47.31,26.83 46.2,25.72 46.2,22.54 46.83,21.91 U4.6
N$17
  Bottom 0.61: C11.2 44.58,16.99 45.56,16.99 46.67,18.1 U4.3
  Bottom 0.813: R16.1 44.58,16.99
N$18
  Bottom 0.61: U4.2 47.15,16.83 46.2,15.87 46.2,14.92 45.59,14.32 C11.1
  Bottom 0.813: R13.1 42.41,14.32 C11.1
N$19
  Top 0.61: U2.3 47.31,16.83 48.77,15.37 C6.2
  Top 0.813: C6.2 52.52,15.37 R9.1
N$20
  Top 0.61: U2.2 46.36,15.56 49.34,12.57 C6.1
  Top 0.813: C6.1 52.52,12.57 R6.1
N$21
  Top 0.61: U2.4 51.12,18.1 51.44,17.78 50.45,17.78 C7.1
  Top 0.813: C7.1 52.42,17.65 R10.1
N$22
  Top 0.61: U2.5 48.42,19.37 49.69,20.64 50.14,20.64 C7.2
  Top 0.813: C7.2 52.52,20.45 R11.1
N$27
  Bottom 0.61: C18.1 44.77,19.4 47.81,19.4 U4.4
  Bottom 0.813: R17.1 42.41,19.4 44.77,19.4
N$28
  Bottom 0.61: U4.5 46.2,20.64 44.64,22.2 C18.2
  Bottom 0.813: R18.1 42.51,22.2 44.64,22.2
N$29
  Bottom 1.778: D+.TP R18.2
N$30
  Bottom 1.778: D-.TP R17.2
N$31
  Bottom 0.61: U4.16 53.5,15.56 53.82,15.24 53.82,13.18 53.79,13.15 C10.1 C9.1 47.5,13.15 47.47,13.18 | 47.47,13.18 47.47,15.24 47.78,15.56 U4.1 | 47.47,13.18 45.72,11.43 42.55,11.43
  Bottom 1.778: 42.55,11.43 E+.TP E+1.TP
N$32
  Bottom 1.778: C-.TP R13.2
N$33
  Bottom 1.778: C+.TP R16.2
N$34
  Top 0.61: U2.16 38.58,14.29 38.58,12.06 38.61,12.04 C4.1 C5.1 45.09,12.04 | 45.09,12.04 45.75,12.04 47.63,10.16 JP1.2 | U2.1 45.09,13.91 45.09,12.04
  Bottom 0.813: JP1.2 JP1.1
N$35
  Top 0.61: D2.C 30.32,54.77 30,55.09 26.06,55.09 26.04,55.07
  Top 1.016: Q4.1 26.04,55.07 R26.2 R27.1
NEXT  (via drill 0.6, 0.6 pad 1.3)
  Top 0.61: U1.26 66.92,27.69 66.9,27.69 v66.83,27.62 | v67.95,6.51 67.95,6.19 69.22,4.92 72.23,4.92 73.66,3.49
  Top 1.016: 73.66,3.49 TC2.P$2
  Bottom 0.61: v66.83,27.62 66.83,13.18 67.95,12.06 v67.95,6.51
RFM_NSS  (via drill 0.35)
  Top 0.61: U3.A5 40.84,38.94 41.79,37.99 52.98,37.99 54.77,36.19 JP8.4 | v70.73,27.52 U1.29
  Bottom 0.61: v70.73,27.52 70.73,30.39 64.93,36.19 JP8.4
RFM_RST
  Top 0.508: U1.13 66.92,46 66.94,45.98 66.52,45.56 61.12,45.56
  Top 0.61: 54.45,39.21 54.93,38.73 JP8.5 | U3.A6 40.66,40.94 42.39,39.21 54.45,39.21 | 61.12,45.56 58.58,43.02 55.56,43.02 54.45,41.91 54.45,39.21
RFM_SCK  (via drill 0.35)
  Top 0.61: U3.A4 37.12,36.83 52.07,36.83 55.25,33.65 JP8.3 | v70.8,26.03 71.28,26.03 72,26.76 U1.30
  Bottom 0.61: JP8.3 58.1,33.65 59.53,35.08 64.29,35.08 69.37,30 69.37,26.67 70.01,26.03 v70.8,26.03
RST
  Top 0.813: R2.1 71.32,52.55 RST.2 | U1.3 79.62,51.82 79.1,52.35 RST.1
  Bottom 0.813: RST.2 74.77,52.35 | 74.77,52.35 RST.1 78.66,52.35 79.61,51.4 79.61,44.37 77.62,42.37 T2.C | C3.1 74.77,52.35
RTS
  Bottom 0.61: JP6.2 77.47,14.29 75.88,12.7 73.34,12.7 72.39,13.65 72.39,23.65 73.18,24.45 73.18,31.59 71.91,32.86 71.91,38.41 R3.1
  Bottom 0.813: R3.1 73.82,39.7 T2.E
RX
  Top 0.61: JP6.5 78.74,21.91 76.93,23.72 76.93,28.79 U1.34
SCL
  Top 0.61: U1.36 79.62,27.69 79.85,27.46 80.96,27.46 83.19,25.24 83.19,11.11 81.92,9.84 68.9,9.84 64.29,5.24 50.48,5.24 48.58,3.33 D1.3 | U2.13 36.51,18.1 30.48,12.06 JP2.5 30.48,6.03 31.43,5.08 36.99,5.08 39.05,3.02 JP4.2
  Bottom 0.61: JP4.2 39.05,3.02 39.21,3.18 R7.1
  Bottom 0.813: R7.1 46.98,4.61 48.58,3.02 D1.3
SCL1  (via drill 0.6 pad 1.3)
  Top 0.406: 62.55,8.89 57.79,8.89 | 62.23,21.59 57.94,21.59
  Top 0.61: U1.27 68.19,25.65 67.95,25.4 64.93,25.4 63.34,26.99 57.94,26.99 v56.52,25.56 56.2,25.24 56.2,23.34 57.94,21.59 | v57.15,8.25 57.79,8.89 | 62.55,8.89 63.66,10 63.66,20.16 62.23,21.59
  Bottom 0.61: U4.13 54.93,19.37 56.2,20.64 56.2,25.24 v56.52,25.56 | R14.1 57.15,9.69 v57.15,8.25
  Bottom 0.813: v57.15,8.25 57.15,7.46 60.17,4.44 JP5.4
SDA
  Top 0.61: U1.33 75.97,28.79 75.81,28.63 75.81,13.36 73.24,10.8 68.42,10.8 63.82,6.19 48.1,6.19 46.04,4.13 D1.4 | 33.1,7.38 32.94,7.54 | U2.14 37.15,16.83 32.7,12.38 32.7,11.43 32.7,7.62 JP2.6
  Top 0.813: 32.94,7.54 32.94,6.19 37.94,6.19 41.59,2.54 JP4.1 45.56,1.75 D1.4 | 33.1,7.38 JP2.6
  Top 1.016: R8.1 32.7,11.43
SDA1  (via drill 0.6 pad 1.3)
  Top 0.406: v57.79,24.13 64.45,24.13
  Top 0.61: U1.28 69.46,24.85 68.74,24.13 64.45,24.13
  Bottom 0.406: 58.74,16.51 62.07,16.51
  Bottom 0.61: 56.99,18.89 56.2,18.1 U4.14 | v57.79,24.13 57.31,23.65 57.31,19.21 56.99,18.89 | 56.99,18.89 R15.1 57.46,17.3 57.94,17.3 58.74,16.51 | 62.07,16.51 63.02,15.56 63.02,3.33 JP5.3
TX
  Top 0.61: U1.35 78.35,27.06 79.22,26.19 80.65,26.19 81.92,24.92 81.92,20.32 80.96,19.37 JP6.4
V+  (via drill 0.35, 0.6 pad 1.3)
  Top 0.61: U2.15 37.62,15.56 36.04,13.97 36.04,11.43
  Top 0.813: v35.88,7.78 35.88,11.43
  Top 1.016: U3.B4 25.35,36.94 25.4,36.99 25.56,36.99 | Q1.3 34.46,53.66 34.46,52.87 31.43,49.85 C16.1 C17.1 31.09,45.85 29.69,44.45 29.69,41.12 25.56,36.99 | R8.2 35.88,11.43 36.04,11.43 | v30.08,33.26 v30.72,33.89 v31.35,34.53 30.56,33.73 29.29,33.73 26.04,36.99 25.56,36.99
  Bottom 0.61: TC2.P$1 69.53,0.64 58.58,0.64 57.63,1.59 JP5.5 | R22.1 33.81,36.98 33.81,36.99
  Bottom 0.813: JP3.3 53.03,52.54 R21.2
  Bottom 1.016: 53.18,48.58 47.63,43.02 39.85,43.02 33.81,36.99 v31.35,34.53 27.15,30.32 27.15,12.7 30,9.84 33.77,9.84 35.88,7.73 | 34.13,36.61 R22.1 | 53.66,2.06 SJ7.1 49.18,5.27 47.31,7.14 39.52,7.14 R7.2 38.9,7.14 35.88,7.14 | JP4.4 33.97,3.65 35.88,5.56 35.88,7.14 | 35.88,7.73 v35.88,7.78 | D1.1 57.63,2.22 JP5.5 | 53.18,48.58 JP3.3 | JP9.2 52.86,48.9 53.18,48.58 | 35.88,7.73 35.88,7.14
  Bottom 1.524: 53.66,2.06 D1.1
VALID  (via drill 0.6, 0.6 pad 1.3)
  Top 0.406: 54.61,32.38 58.58,32.38 | 26.67,3.97 26.67,9.21
  Top 0.508: 26.67,3.97 25.4,2.7 TC1.P$2
  Top 0.61: v48.74,35.4 51.59,35.4 54.61,32.38 | U1.24 64.01,32.38 58.58,32.38 | 26.67,9.21 26.67,9.37 28.1,10.8 28.1,13.97 v29.05,14.92
  Bottom 0.61: v48.74,35.4 48.74,35.31 42.16,28.73 34.45,28.73 32.7,26.99 32.7,16.03 31.59,14.92 v29.05,14.92
VALIM  (via drill 0.6 pad 1.3)
  Top 0.61: U1.7 74.52,46.98 74.52,48.83 72.55,50.8 61.44,50.8 60.33,51.91 60.33,53.97 59.53,54.77 51.75,54.77 50.64,53.66 50.64,52.39 49.53,51.28 48.26,51.28 v46.83,52.7
  Bottom 0.61: v46.83,52.7 Q3.2
  Bottom 1.016: R24.1 44.43,54.29 C20.1 44.57,54.15 Q3.2
VBAT  (via drill 0.6, 0.6 pad 1.3)
  Top 0.508: U1.6 75.81,50.23 v75.25,50.8
  Top 0.61: Q5.2 61.92,52.87 62.56,52.23 v64.61,52.23
  Bottom 0.508: v75.25,50.8 70.01,50.8
  Bottom 0.61: 68.58,53.82 68.58,52.23 70.01,50.8 | C21.1 66.07,53.69 v64.61,52.23
  Bottom 1.016: C21.1 68.4,53.69 R28.1 68.58,53.82
VCC  (via drill 0.35, 0.6)
  Top 0.406: 21.59,5.24 21.59,8.73
  Top 0.61: R20.2 66.36,57.15 | TC1.P$1 22.86,3.97 21.59,5.24 | v25.56,12.7 21.59,8.73 | Q4.2 25.7,57.31 23.02,57.31
  Top 0.813: U1.2 80.89,48.83 v81.12,49.05
  Top 1.016: 37.61,57.15 26.18,57.15 Q4.2 | Q1.2 37.61,57.15 | 37.61,57.15 41.43,57.15 | 41.43,57.15 43.82,57.15 | 43.82,57.15 66.36,57.15 68.74,57.15 R2.2 69.59,55.54 70.17,54.77 79.06,54.77 80.84,52.99 80.96,52.71 80.96,49.21 v81.12,49.05 | R5.2 41.43,57.15 | 43.82,57.15 43.82,47.78 42.7,46.67 v42.7,44.77 | v43.82,44.77 v41.59,44.77 | v34.93,51.12 34.93,50 PWR_ERR.A
  Bottom 0.305: U5.4 32.09,55.7 32.07,55.72 32.39,55.72 32.39,55.56
  Bottom 0.61: 32.39,55.56 32.39,54.77
  Bottom 0.813: C1.1 79.72,33.79 81.6,31.91 81.6,16.83 JP6.3 77.15,16.83 76.04,17.94 76.04,24.45 77.94,26.35 R1.1 | 32.39,54.77 32.7,54.77
  Bottom 1.016: v81.12,49.05 81.12,43.5 79.72,42.1 C2.1 C1.1 | v42.7,44.77 39.21,44.77 37.7,43.26 | 37.7,43.26 25.56,31.12 v25.56,12.7 | v41.59,44.77 v42.7,44.77 | v42.7,44.77 v43.82,44.77 | 37.7,43.26 34.93,46.04 34.93,47.12 C14.1 C15.1 35.95,50.69 v34.93,51.12 34.93,53.34 33.5,54.77 32.7,54.77

### Text on the board
Top: V1.54
tNames: V+ / / DHT / / gnd | gnd / / V+ | with external antenna / connected on J1, cut here | DIO0 / / RFM_RST / / RFM_NSS / / RFM_SCK / / MOSI / / MISO | Dtr | Rx | DIO0 | DIO3 | Tx | Vcc | UCA antenna designed by / Fabien Ferrero | Rts | (users.polytech.unice.fr/~ferrero/recherche.html) | GND | V+ / / SCL1 / / SDA1 / / DRDY1 / gnd | gnd / / V+ / / DRDY / / SCL / / SDA
bNames: +12V / GND | LoRa Bee Scale V1.54 / Christian.PETER / @univ-cotedazur.fr | Short SJ7 if U4 used | E- / / E- / / B+ / / B- / / A+ / / A- / / E+ / / E+ | sda / / scl / / 3.3 / / 3.3 / / +12 / / +12 | gnd / / gnd / / gnd / / ce / / al_bat